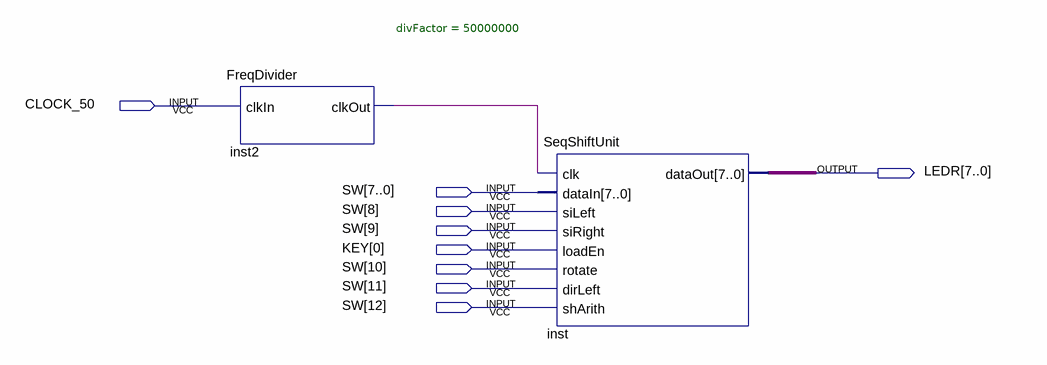
[diagram p0: schematic sheet]
// Quartus schematic SeqShiftUnit_Demo.bdf as structural Verilog: 2 symbols, 9 pins
module SeqShiftUnit_Demo (
  input  CLOCK_50,
  input  [12:0] SW,
  input  [0:0] KEY,
  output [7:0] LEDR
);

  wire inst2_clkout;

  FreqDivider #(.divFactor(50000000)) inst2 (.clkIn(CLOCK_50), .clkOut(inst2_clkout));
  SeqShiftUnit inst (
    .clk(inst2_clkout), .dataIn(SW[7:0]), .siLeft(SW[8]), .siRight(SW[9]), .loadEn(KEY[0]), .rotate(SW[10]),
    .dirLeft(SW[11]), .shArith(SW[12]), .dataOut(LEDR));
endmodule
